# EAGLE design mp28164-buck-boost-flashlight-driver-17mm-mk-1.0.0 (EAGLE 9.2.2)
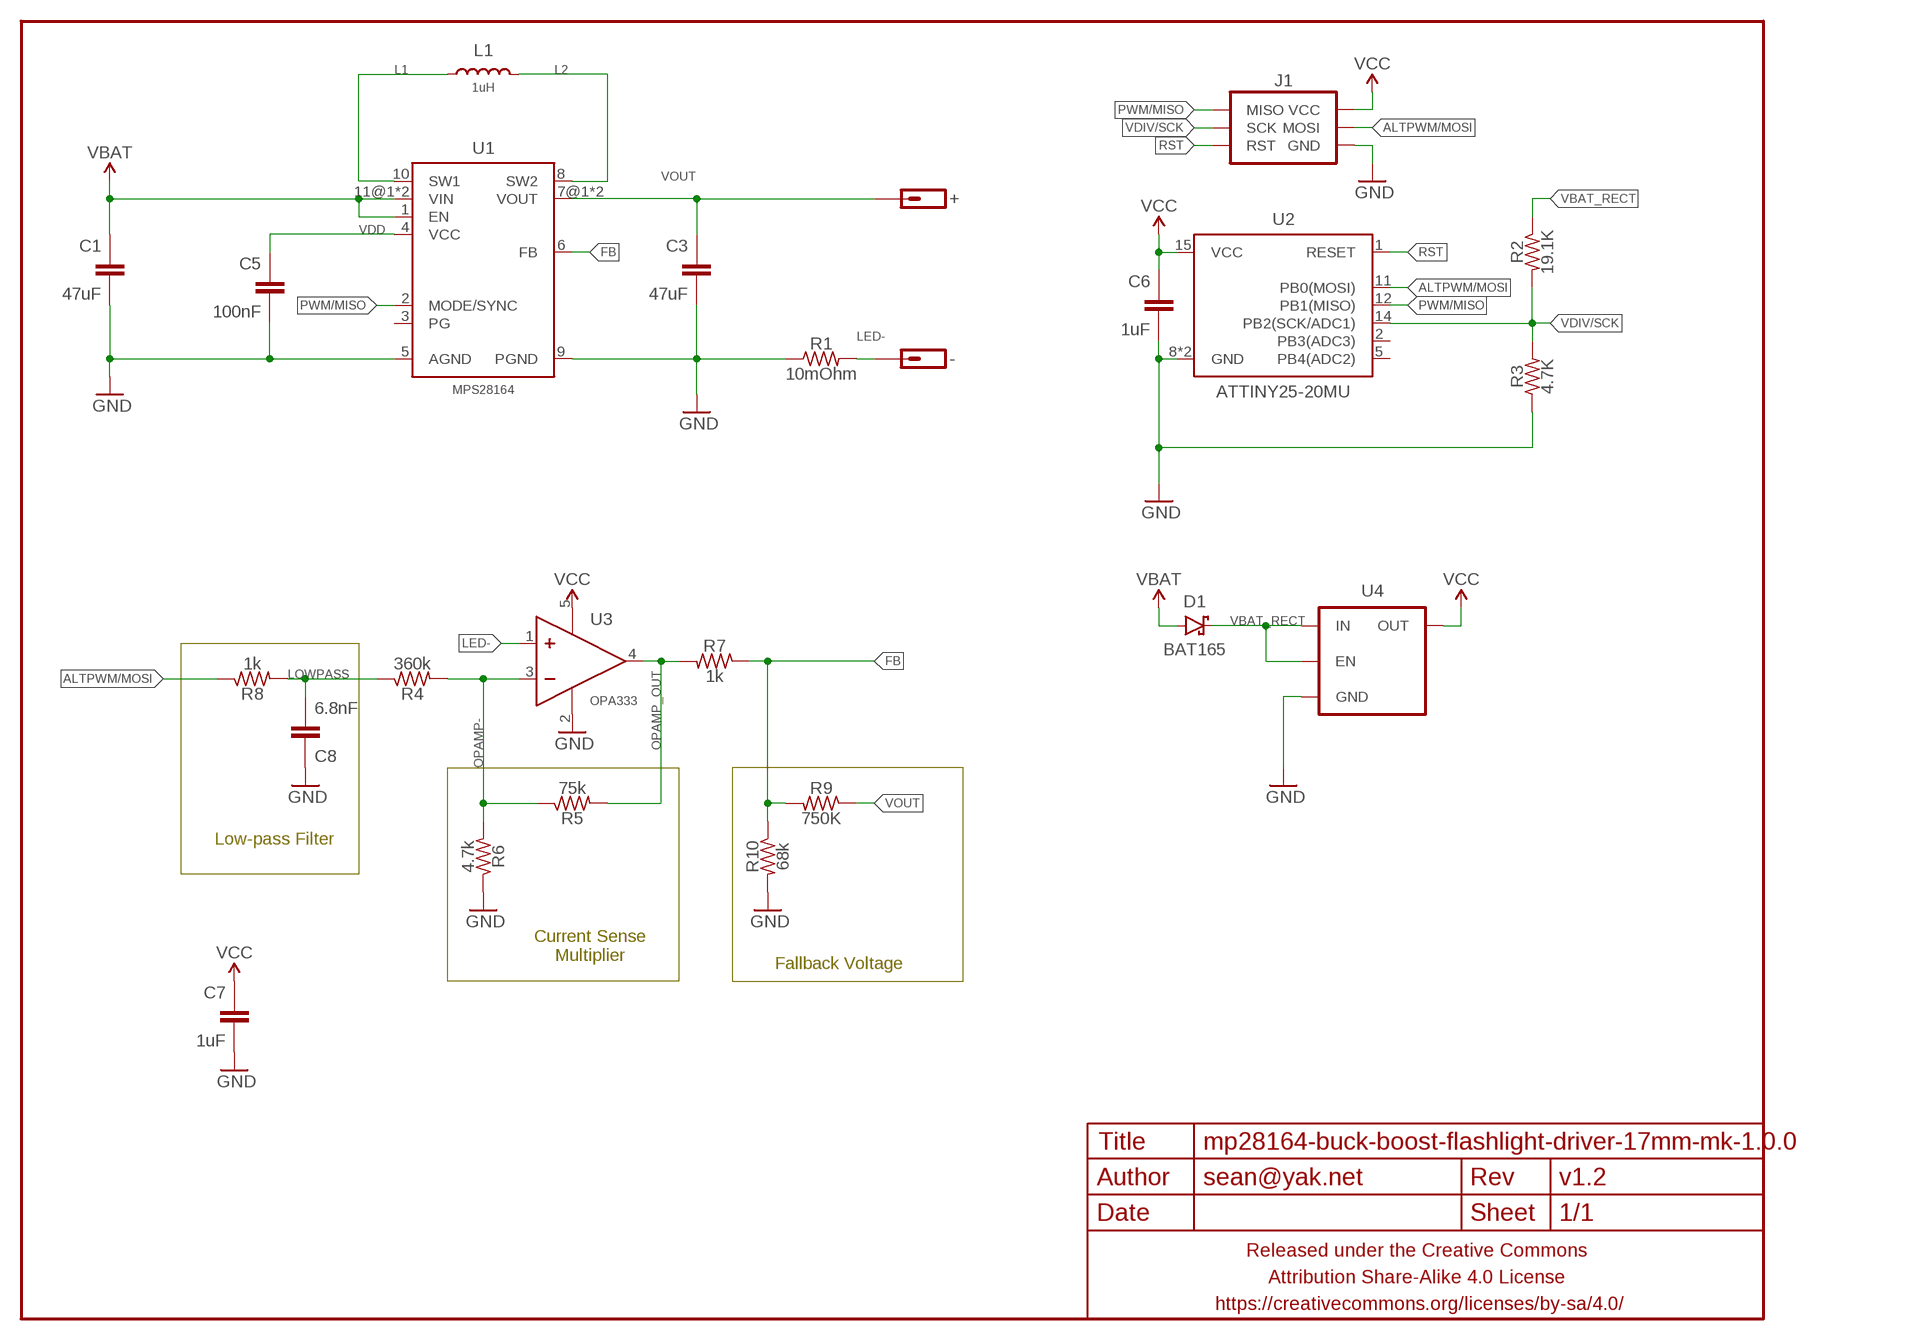
[diagram p0: schematic, sheet 1]

## Parts
+  M01SMD-1.6MMX3.2MM-NS  [1X01-SMD-1.6MMX3.2MM-NS]
-  M01SMD-1.6MMX3.2MM-NS  [1X01-SMD-1.6MMX3.2MM-NS]
C1  47uF  CAPACITOR-CERAMICC1206  [C1206]
C3  47uF  CAPACITOR-CERAMICC1206  [C1206]
C5  100nF  CAPACITOR-CERAMICC0402  [C0402]
C6  1uF  CAPACITOR-CERAMICC0402  [C0402]
C7  1uF  CAPACITOR-CERAMICC0402  [C0402]
C8  6.8nF  CAPACITOR-CERAMICC0402  [C0402]
D1  BAT165  DIODE-SCHOTTKYSOD323  [SOD323-SCHOTTKY]
FRAME1  FRAME-LETTERNO_PACKAGE  [DUMMY]
J1  AVR_SPI_PRG_6SMD-1.27MM  [2X3-1.27MM-SMD]
L1  1uH  INDUCTORXAL7070  [XAL7070]
R1  10mOhm  RESISTORR0805-TIGHTER  [R0805-TIGHTER]
R2  19.1K  RESISTORR0402  [R0402]
R3  4.7K  RESISTORR0402  [R0402]
R4  360k  RESISTORR0402  [R0402]
R5  75k  RESISTORR0402  [R0402]
R6  4.7k  RESISTORR0402  [R0402]
R7  1k  RESISTORR0402  [R0402]
R8  1k  RESISTORR0402  [R0402]
R9  750K  RESISTORR0402  [R0402]
R10  68k  RESISTORR0402  [R0402]
U1  MPS28164  [MPS28164]
U2  ATTINY25-20MU  ATTINY45TINY85-20-QFN  [QFN20]
U3  OPA333  OPAMPOPA333-SC-70  [SC70]
U4  V_REG_ENTLV700  [SC70]

## Nets
ALTPWM/MOSI: J1.4(MOSI) R8.1 U2.11(PB0(MOSI))
FB: R7.1 R9.2 R10.1 U1.6(FB)
GND: C1.2 C3.2 C5.2 C6.2 C7.2 C8.1 J1.6(GND) R1.1 R3.1 R6.1 R10.2 U1.5(AGND) U1.9(PGND) U2.8(GND) U2.PAD(GND) U3.2(V-) U4.2(GND)
L1: L1.P$1 U1.10(SW1)
L2: L1.P$2 U1.8(SW2)
LED-: -.P$1 R1.2 U3.1(IN+)
LOWPASS: C8.2 R4.1 R8.2
OPAMP-: R4.2 R5.1 R6.2 U3.3(IN-)
OPAMP_OUT: R5.2 R7.2 U3.4(OUT)
PWM/MISO: J1.1(MISO) U1.2(MODE/SYNC) U2.12(PB1(MISO))
RST: J1.5(RST) U2.1(RESET)
VBAT: C1.1 D1.A U1.1(EN) U1.11@1(VIN) U1.11@2(VIN)
VBAT_RECT: D1.C R2.1 U4.1(IN) U4.3(EN)
VCC: C6.1 C7.1 J1.2(VCC) U2.15(VCC) U3.5(V+) U4.5(OUT)
VDD: C5.1 U1.4(VCC)
VDIV/SCK: J1.3(SCK) R2.2 R3.2 U2.14(PB2(SCK/ADC1))
VOUT: +.P$1 C3.1 R9.1 U1.7@1(VOUT) U1.7@2(VOUT)
Unconnected: U1.3(PG) U2.2(PB3(ADC3)) U2.5(PB4(ADC2))

## Notes on the sheet
- Low-pass Filter
- Current Sense
  Multiplier
- Fallback Voltage

## Library data of the parts
+ - = a_parts:M01: Header 1 Standard 1-pin 0.1" header. Use with straight break away headers (SKU : PRT-00116), right angle break away headers (PRT-00553), swiss pins (PRT-00743), machine pins (PRT-00117), and female headers (PRT-00115).
C1 C3 C5-C8 = a_parts:CAPACITOR-CERAMIC: CAPACITOR, European symbol
D1 = a_parts:DIODE-SCHOTTKY: Schottky diodes in SFE's production catalog BAT20J 1A 23V 0.62Vf RB751 120mA 40V 0.37Vf PMEG4005EJ 0.5A 40V 0.42Vf MBRA140 1A 40V 0.5Vf B340A 3A 40V SMA
FRAME1 = a_parts:FRAME-LETTER: Schematic Frame Standard 8.5x11 US Letter frame; DESIGNER: sean@yak.net; VERSION: v1.2
J1 = a_parts:AVR_SPI_PRG_6: AVR ISP 6 Pin This is the reduced ISP connector for AVR programming. Common on Arduino. This footprint will take up less PCB space and can be used with a 10-pin to 6-pin adapter such as SKU: BOB-08508 **Special note about "TEST_POINT" package. The stop mask is on the top side, so if you want your programming test points to be on the bottom of your board, make sure to place this package on the bottom side of the board. This also ensure that the orientation to program from the bottom side will be correct.
L1 = a_parts:INDUCTOR: Inductors Basic Inductor/Choke - 0603 and 1206. Footprints are not proven and vary greatly between part numbers. SRN6045- 33uH, 20% 1.4A SDR0403-560KL - 56uH, 10%, 500mA RMS/740mA peak
R1-R10 = a_parts:RESISTOR: RESISTOR, American symbol
U1 = a_parts:MPS28164
U2 = a_parts:ATTINY45: Atmel 8-pin 2/4/8kB flash uC
U3 = a_parts:OPAMP
U4 = a_parts:V_REG_EN

## Board
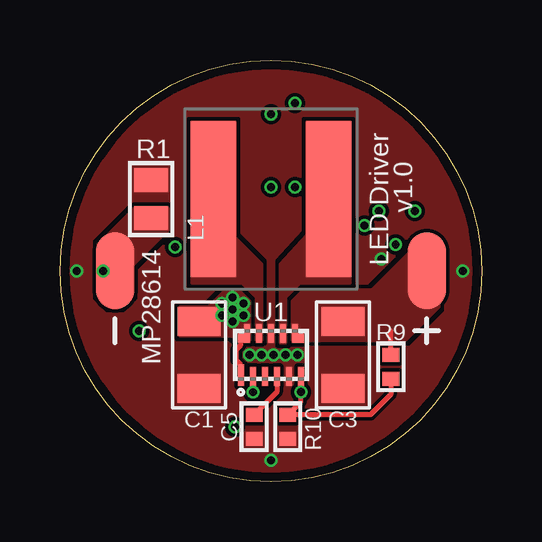
[diagram p1: board, top side]
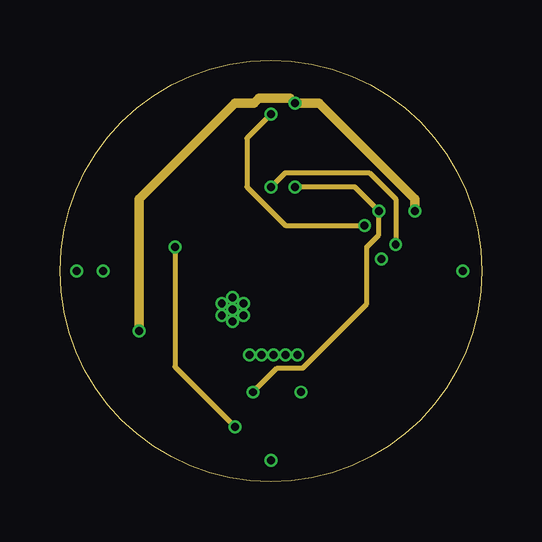
[diagram p2: board, inner layer Route2]
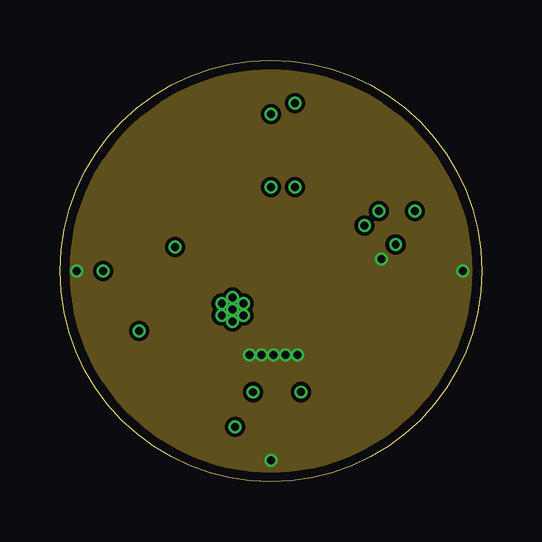
[diagram p3: board, inner layer Route15]
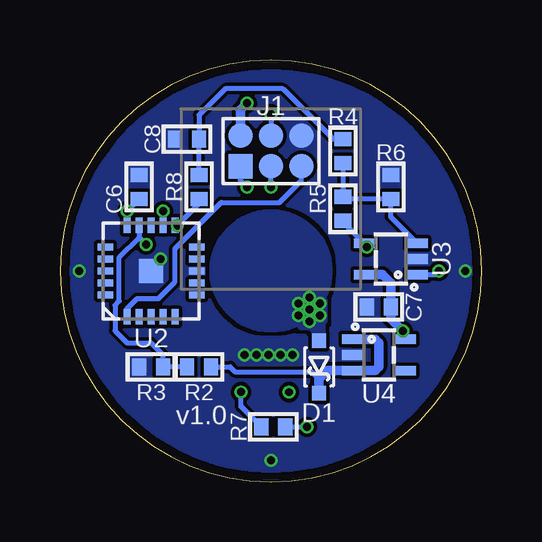
[diagram p4: board, bottom side, seen from below]

Size 17.6 x 17.6 mm. Coordinates in mm from the lower left corner, seen from the top.
Outline: 0,8.8 arc-180 17.6,8.8 arc-180 0,8.8
Copper layers (1*2*15*16): Top 0.035559375mm / dielectric 0.17018125mm / Route2 0.01778125mm / dielectric 47mil / Route15 0.01778125mm / dielectric 0.17018125mm / Bottom 0.035559375mm
Design rules "oshpark-4layer *": minimum track width 5mil, minimum drill 10mil, track to track 5mil, track to pad 5mil, pad to pad 5mil, via to via 5mil, smd to smd 0mil, copper to edge 15mil, drill to drill 6mil, minimum pad ring 4mil, minimum via ring 4mil, stop-mask expansion 2.5mil, vias tented up to drill 0mil, thermal gap 10mil

### Footprints (pad centres in the part's own frame; a part is rotated, then mirrored left to right if it is on the bottom)
1X01-SMD-1.6MMX3.2MM-NS = smd 1.6 x 3.2: P$1 0,0
C1206 = smd 1.2 x 1.8: 1 -1.4,0; 2 1.4,0
C0402 = smd 0.6 x 0.7: 1 -0.5,0; 2 0.5,0
SOD323-SCHOTTKY = smd 0.6 x 0.6: A -1.1,0; C 1.1,0
2X3-1.27MM-SMD = smd 1.016 x 1.016: 1 -1.27,-0.635; 2 -1.27,0.635; 3 0,-0.635; 4 0,0.635; 5 1.27,-0.635; 6 1.27,0.635
XAL7070 = smd 1.9 x 6.5: P$1 -2.41,0; P$2 2.41,0
R0805-TIGHTER = smd 1 x 1.4: 1 -0.8,0; 2 0.8,0
R0402 = smd 0.6 x 0.7: 1 -0.5,0; 2 0.5,0
MPS28164 = smd 0.9 x 0.25: 1 -0.85,1.25 | smd 0.8 x 0.25: 2 -0.9,0.75; 3 -0.9,0.25; 4 -0.9,-0.25; 5 -0.9,-0.75; 6 -0.9,-1.25; 7@1 0.9,-1; 8 0.9,-0.5; 9 0.9,0; 10 0.9,0.5; 11@1 0.9,1 | smd 0.4 x 0.25: 7@2 0.7,-1.25; 11@2 0.71,1.25
QFN20 = smd 0.65 x 0.3: 1 -1.9,1; 2 -1.9,0.5; 3 -1.9,0; 4 -1.9,-0.5; 5 -1.9,-1; 11 1.9,-1; 12 1.9,-0.5; 13 1.9,0; 14 1.9,0.5; 15 1.9,1 | smd 0.3 x 0.65: 6 -1,-1.9; 7 -0.5,-1.9; 8 0,-1.9; 9 0.5,-1.9; 10 1,-1.9; 16 1,1.9; 17 0.5,1.9; 18 0,1.9; 19 -0.5,1.9; 20 -1,1.9 | smd 1 x 1: PAD 0,0
SC70 = smd 0.4 x 0.9: 1 -0.65,-1.1; 2 0,-1.1; 3 0.65,-1.1; 4 0.65,1.1; 5 -0.65,1.1

### Placement (x,y rotation side)
+  15.3,8.8 180 top
-  2.3,8.8 180 top
C1  5.8,5.3 270 top
C3  11.8,5.3 270 top
C5  8.1,2.3 270 top
C6  14.3,12.3 90 bottom
C7  4.3,7.3 180 bottom
C8  12.3,14.3 0 bottom
D1  6.8,4.8 270 bottom
FRAME1  -0.2,-0.2 0 top
J1  8.8,13.8 0 bottom
L1  8.8,11.8 0 top
R1  3.8,11.8 270 top
R2  11.8,4.8 180 bottom
R3  13.8,4.8 0 bottom
R4  5.8,13.8 270 bottom
R5  5.8,11.4 270 bottom
R6  3.8,12.3 270 bottom
R7  8.7,2.3 0 bottom
R8  11.8,12.3 90 bottom
R9  13.8,4.8 270 top
R10  9.5,2.3 270 top
U1  8.8,5.3 90 top
U2  13.8,8.8 90 bottom
U3  3.8,9.3 90 bottom
U4  4.3,5.3 270 bottom

### Tracks (layer width: path | path; a pad name or v marks a point on that pad's centre or on a via)
ALTPWM/MOSI  (via drill 0.33)
  Route2 0.2: v8.8,15.34 7.8,14.34 7.8,12.3 9.4,10.7 v12.71,10.7
  Bottom 0.2: U2.11 v12.71,10.7 11.8,11.61 R8.1 | v8.8,15.34 J1.4
FB  (via drill 0.33)
  Top 0.2: U1.6 v10.05,3.75 | v10.05,3.75 | R9.2 13.8,3.64 12.96,2.8 R10.1 10.05,3.35 v10.05,3.75
  Bottom 0.2: R7.1 10.05,3.15 v10.05,3.75
GND  (via drill 0.33)
  other vias: 0.7,8.8 16.8,8.8 8.8,0.9 8.9,5.3 8.4,5.3 7.9,5.3 9.4,5.3 9.9,5.3 13.4,9.3
  pour Bottom (isolate 0.152, rank 6, no thermals): 8.8,0 arc-90 0,8.8 arc-90 8.8,17.6 arc-90 17.6,8.8 arc-90
  pour Top (isolate 0.152, rank 6, no thermals): 8.8,0 arc-90 0,8.8 arc-90 8.8,17.6 arc-90 17.6,8.8 arc-90
  pour Route15 (isolate 0.152, rank 6, no thermals): 8.8,0 arc-90 0,8.8 arc-90 8.8,17.6 arc-90 17.6,8.8 arc-90
L1
  pour Top (no thermals): 8.2,7.7 8.2,5.9 8.4,5.9 8.4,9.1 7.3,10.2 7.3,15 5.5,15 5.5,8.3 7.6,8.3
L2
  pour Top (rank 2, no thermals): 9.2,5.8 9.2,9.1 10.3,10.3 10.3,15 12.1,15 12.1,8.3 10,8.3 9.4,7.7 9.4,5.8
LED-  (via drill 0.33)
  Top 0.2: -.P$1 v1.8,8.8
  Bottom 0.2: U3.1 1.95,8.65 v1.8,8.8
  pour Top (rank 3, no thermals): 1.6,9.9 1.6,7.8 2.1,7.3 2.5,7.3 3,7.8 3,9 4.5,10.5 4.5,11.4 3.1,11.4
LOWPASS
  Bottom 0.2: R4.1 6.2,14.3 8.3,16.4 10.7,16.4 11.8,15.3 C8.2 R8.2
OPAMP-
  Bottom 0.2: U3.3 3.8,11.05 R6.2 5.7,11.8 R5.1 R4.2
OPAMP_OUT  (via drill 0.33)
  Route2 0.2: v4.8,9.8 4.8,4.8 v7.3,2.3
  Bottom 0.2: R7.2 v7.3,2.3 | v4.8,9.8 4.8,9.85 U3.4 5.8,10.85 R5.2
PWM/MISO  (via drill 0.33)
  Top 0.2: U1.2 v8.05,3.75
  Route2 0.2: v8.05,3.75 9.06,4.76 10.13,4.76 12.8,7.43 12.8,9.8 13.3,10.3 v13.3,11.3 12.3,12.3 v9.8,12.3
  Bottom 0.2: U2.12 v13.3,11.3 | v9.8,12.3 10.07,12.57 J1.1
RST
  Bottom 0.2: U2.1 14.8,7.23 14.38,7.65 13.5,7.65 12.8,8.34 12.8,9.73 10.87,11.66 8.44,11.66 7.53,12.57 J1.5
VBAT  (via drill 0.33)
  Top 0.2: U1.1 7.55,4.88 7.36,5.07 7.36,5.53 7.55,5.72 U1.11@2
  other vias: 7.65,7.45 7.65,6.95 7.2,7.2 6.75,7.45 7.2,7.7 7.2,6.7 6.75,6.95
  pour Bottom (isolate 0.152, no thermals): 6.3,8.8 arc-180 11.3,8.8 arc-180
  pour Top (rank 2, no thermals): 5,7.3 5,6.1 7.2,6.1 7.4,5.9 7.9,5.9 7.9,7.6 7.6,7.9 6.8,7.9 6.2,7.3
  pour Bottom (rank 2, no thermals): 6.5,7.6 6.5,6.7 6.6,6.6 6.6,5.7 7,5.7 7,6.2 7.2,6.4 7.6,6.4 7.9,6.8 7.9,7.6 7.5,8 6.9,8
VBAT_RECT
  Bottom 0.2: R2.1 10.5,4.8 10.3,4.6 7.1,4.6 6.8,4.3
  Bottom 0.4: U4.1 4.45,5.95 4.3,5.8 4.3,4.8 4.45,4.65 U4.3 6.45,4.65 6.8,4.3 D1.C
VCC  (via drill 0.33)
  Route2 0.4: v3.3,6.3 3.3,11.8 7.3,15.8 8.1,15.8 8.3,16 9.6,16 v9.8,15.8 10.8,15.8 14.8,11.8 v14.8,11.3
  Bottom 0.2: U2.15 v14.8,11.3 C6.1
  Bottom 0.4: U4.5 3.3,6.05 v3.3,6.3 3.8,6.8 C7.1 3.8,8.3 4.15,8.65 U3.5 | J1.2 10.07,15.53 v9.8,15.8
VDD
  Top 0.2: U1.4 9.05,3.75 C5.1
VDIV/SCK  (via drill 0.33)
  Route2 0.2: v8.8,12.3 9.4,12.9 12.9,12.9 14,11.8 v14,9.9
  Bottom 0.2: R2.2 R3.2 13.3,5.3 13.8,5.8 14.8,5.8 15.3,6.3 15.3,7.37 15.12,7.55 15.12,9.37 14.3,10.2 | v8.8,12.3 J1.3 | U2.14 14.3,10.2 | 14.3,10.2 v14,9.9
VOUT
  Top 0.2: R9.1 13.8,6.3
  pour Top (rank 3, no thermals): 9.7,7.6 9.7,5.9 14.4,5.9 15.8,7.3 15.8,9.8 15.3,10.3 13,8 10.1,8

### Text on the board
tPlace: LED Driver | MP28614